# EAGLE schematic connection_final (EAGLE 7.2.1)
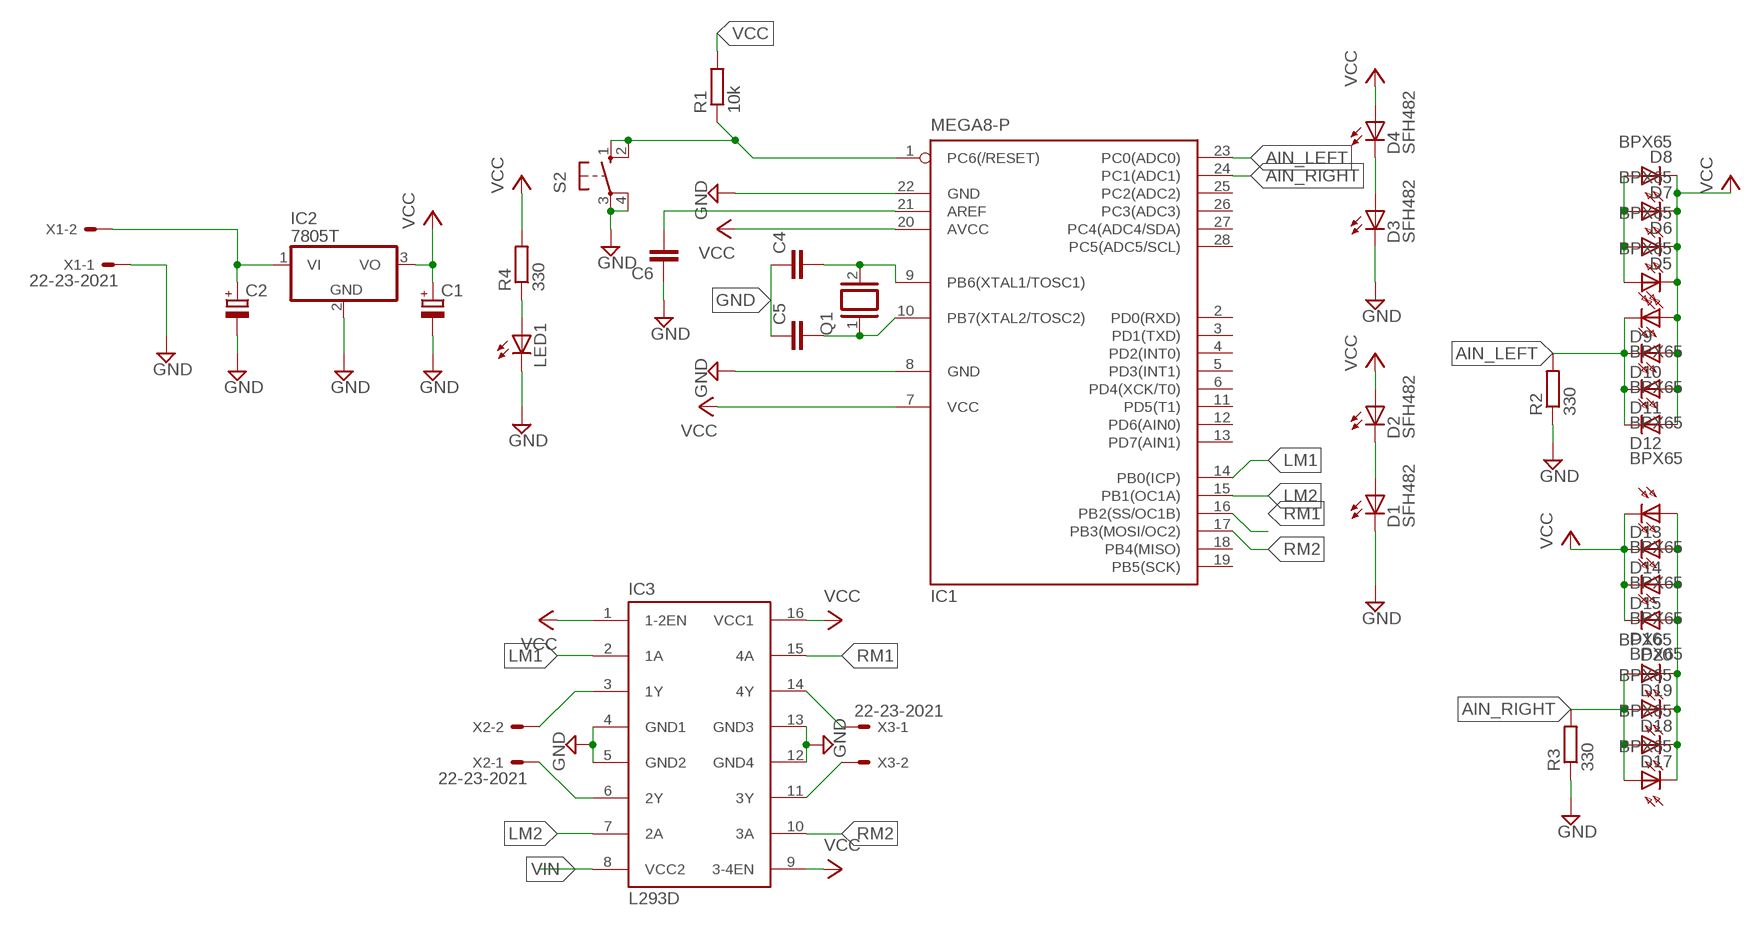
[diagram p0: schematic, sheet 1]

## Parts
C1  CPOL-EUE3.5-8  [E3,5-8]
C2  CPOL-EUE3.5-8  [E3,5-8]
C4  C5/2.5  [C5B2.5]
C5  C5/2.5  [C5B2.5]
C6  C5/2.5  [C5B2.5]
D1  SFH482  [SFH482]
D2  SFH482  [SFH482]
D3  SFH482  [SFH482]
D4  SFH482  [SFH482]
D5  BPX65  [BPX65]
D6  BPX65  [BPX65]
D7  BPX65  [BPX65]
D8  BPX65  [BPX65]
D9  BPX65  [BPX65]
D10  BPX65  [BPX65]
D11  BPX65  [BPX65]
D12  BPX65  [BPX65]
D13  BPX65  [BPX65]
D14  BPX65  [BPX65]
D15  BPX65  [BPX65]
D16  BPX65  [BPX65]
D17  BPX65  [BPX65]
D18  BPX65  [BPX65]
D19  BPX65  [BPX65]
D20  BPX65  [BPX65]
IC1  MEGA8-P  [DIL28-3]
IC2  7805T  [TO220H]
IC3  L293D  [DIL16]
LED1  LED5MM  [LED5MM]
Q1  XTAL/S  [QS]
R1  10k  R-EU_0204/5  [0204/5]
R2  330  R-EU_0204/5  [0204/5]
R3  330  R-EU_0204/5  [0204/5]
R4  330  R-EU_0204/5  [0204/5]
S2  10-XX  [B3F-10XX]
X1  22-23-2021  [22-23-2021]
X2  22-23-2021  [22-23-2021]
X3  22-23-2021  [22-23-2021]

## Nets
AIN_LEFT: D9.K(C) D10.K(C) D11.K(C) D12.K(C) IC1.23(PC0(ADC0)) R2.2
AIN_RIGHT: D17.A D18.A D19.A D20.A IC1.24(PC1(ADC1)) R3.2
GND: C1.- C2.- C4.1 C5.1 C6.1 D1.K(C) D3.K(C) IC1.8(GND) IC1.22(GND) IC2.2(GND) IC3.4(GND1) IC3.5(GND2) IC3.12(GND4) IC3.13(GND3) LED1.K(C) R2.1 R3.1 S2.3(P) S2.4(P1) X1.1
LM1: IC1.14(PB0(ICP)) IC3.2(1A)
LM2: IC1.15(PB1(OC1A)) IC3.7(2A)
N$1: IC1.1(PC6(/RESET)) R1.1 S2.1(S) S2.2(S1)
N$2: C6.2 IC1.21(AREF)
N$3: C4.2 IC1.9(PB6(XTAL1/TOSC1)) Q1.2
N$4: C5.2 IC1.10(PB7(XTAL2/TOSC2)) Q1.1
N$5: D3.A D4.K(C)
N$6: D1.A D2.K(C)
N$7: D5.A D6.A D7.A D8.A
N$8: IC3.3(1Y) X2.2
N$9: IC3.6(2Y) X2.1
N$10: IC3.14(4Y) X3.1
N$11: D13.A D14.A D15.A D16.A D17.K(C) D18.K(C) D19.K(C) D20.K(C)
N$12: IC3.11(3Y) X3.2
N$13: LED1.A R4.1
RM1: IC1.16(PB2(SS/OC1B)) IC3.15(4A)
RM2: IC1.17(PB3(MOSI/OC2)) IC3.10(3A)
VCC: C1.+ D2.A D4.A D5.K(C) D6.K(C) D7.K(C) D8.K(C) D9.A D10.A D11.A D12.A D13.K(C) D14.K(C) D15.K(C) D16.K(C) IC1.7(VCC) IC1.20(AVCC) IC2.3(VO) IC3.1(1-2EN) IC3.9(3-4EN) IC3.16(VCC1) R1.2 R4.2
VIN: C2.+ IC2.1(VI) IC3.8(VCC2) X1.2
Unconnected: IC1.2(PD0(RXD)) IC1.3(PD1(TXD)) IC1.4(PD2(INT0)) IC1.5(PD3(INT1)) IC1.6(PD4(XCK/T0)) IC1.11(PD5(T1)) IC1.12(PD6(AIN0)) IC1.13(PD7(AIN1)) IC1.18(PB4(MISO)) IC1.19(PB5(SCK)) IC1.25(PC2(ADC2)) IC1.26(PC3(ADC3)) IC1.27(PC4(ADC4/SDA)) IC1.28(PC5(ADC5/SCL))

## Library data of the parts
C1 C2 = resistor:CPOL-EU: POLARIZED CAPACITOR, European symbol
C4-C6 = capacitor-wima:C: CAPACITOR naming: grid - package width
D1-D4 = led:SFH482: IR LED infrared emitting diode, Infineon
D5-D20 = opto-trans-siemens:BPX65: PHOTO DIODE; MPN: BPX65.; OC_FARNELL: 327451; OC_NEWARK: 06WX2764
IC1 = atmel:MEGA8-P: MICROCONTROLLER 8 Kbytes FLASH, 1 kbytes SRAM, 512 bytes EEPROM, USART, 4-channel 10 bit ADC, 2-channel 8 bit ADC Pin compatible with Atmega48, ATMega88, ATMega168 Source: avr.lbr; OC_FARNELL: unknown; OC_NEWARK: unknown
IC2 = linear:78*: Positive VOLTAGE REGULATOR Source: http://cache.national.com/ds/LM/LM78L05.pdf http://www.fairchildsemi.com/ds/LM/LM7805.pdf
IC3 = st-microelectronics:L293D: PUSH-PULL 4 CHANNEL DRIVER; MPN: L293D; OC_FARNELL: 9589619; OC_NEWARK: 56P8249
LED1 = led:LED: LED OSRAM: - CHIPLED LG R971, LG N971, LY N971, LG Q971, LY Q971, LO R971, LY R971 LH N974, LH R974 LS Q976, LO Q976, LY Q976 LO Q996 - Hyper CHIPLED LW Q18S LB Q993, LB Q99A, LB R99A - SideLED LS A670, LO A670, LY A670, LG A670, LP A670 LB A673, LV A673, LT A673, LW A673 LH A674 LY A675 LS A676, LA A676, LO A676, LY A676, LW A676 LS A679, LY A679, LG A679 - Hyper Micro SIDELED® LS Y876, LA Y876, LO Y876, LY Y876 LT Y87S - SmartLED LW L88C, LW L88S LB L89C, LB L89S, LG L890 LS L89K, LO L89K, LY L89K LS L896, LA L896, LO L896, LY L896 - TOPLED LS T670, LO T670, LY T670, LG T670, LP T670 LSG T670, LSP T670, LSY T670, LOP T670, LYG T670 LG T671, LOG T671, LSG T671 LB T673, LV T673, LT T673, LW T673 LH T674 LS T676, LA T676, LO T676, LY T676, LB T676, LH T676, LSB T676, LW T676 LB T67C, LV T67C, LT T67C, LS T67K, LO T67K, LY T67K, LW E67C LS E67B, LA E67B, LO E67B, LY E67B, LB E67C, LV E67C, LT E67C LW T67C LS T679, LY T679, LG T679 LS T770, LO T770, LY T770, LG T770, LP T770 LB T773, LV T773, LT T773, LW T773 LH T774 LS E675, LA E675, LY E675, LS T675 LS T776, LA T776, LO T776, LY T776, LB T776 LHGB T686 LT T68C, LB T68C - Hyper Mini TOPLED® LB M676 - Mini TOPLED Santana® LG M470 LS M47K, LO M47K, LY M47K Source: http://www.osram.convergy.de LUXEON: - LUMILED® LXK2-PW12-R00, LXK2-PW12-S00, LXK2-PW14-U00, LXK2-PW14-V00 LXK2-PM12-R00, LXK2-PM12-S00, LXK2-PM14-U00 LXK2-PE12-Q00, LXK2-PE12-R00, LXK2-PE12-S00, LXK2-PE14-T00, LXK2-PE14-U00 LXK2-PB12-K00, LXK2-PB12-L00, LXK2-PB12-M00, LXK2-PB14-N00, LXK2-PB14-P00, LXK2-PB14-Q00 LXK2-PR12-L00, LXK2-PR12-M00, LXK2-PR14-Q00, LXK2-PR14-R00 LXK2-PD12-Q00, LXK2-PD12-R00, LXK2-PD12-S00 LXK2-PH12-R00, LXK2-PH12-S00 LXK2-PL12-P00, LXK2-PL12-Q00, LXK2-PL12-R00 Source: www.luxeon.com KINGBRIGHT: KA-3528ASYC Source: www.kingbright.com
Q1 = special:XTAL/S: CRYSTAL
R1-R4 = resistor:R-EU_: RESISTOR, European symbol
S2 = switch-omron:10-XX: OMRON SWITCH; MPN: B3F-1000; OC_FARNELL: 176432; OC_NEWARK: 36M3542
X1-X3 = con-molex:22-23-2021: .100" (2.54mm) Center Header - 2 Pin; MF: MOLEX; MPN: 22-23-2021; OC_FARNELL: 1462926; OC_NEWARK: 25C3832